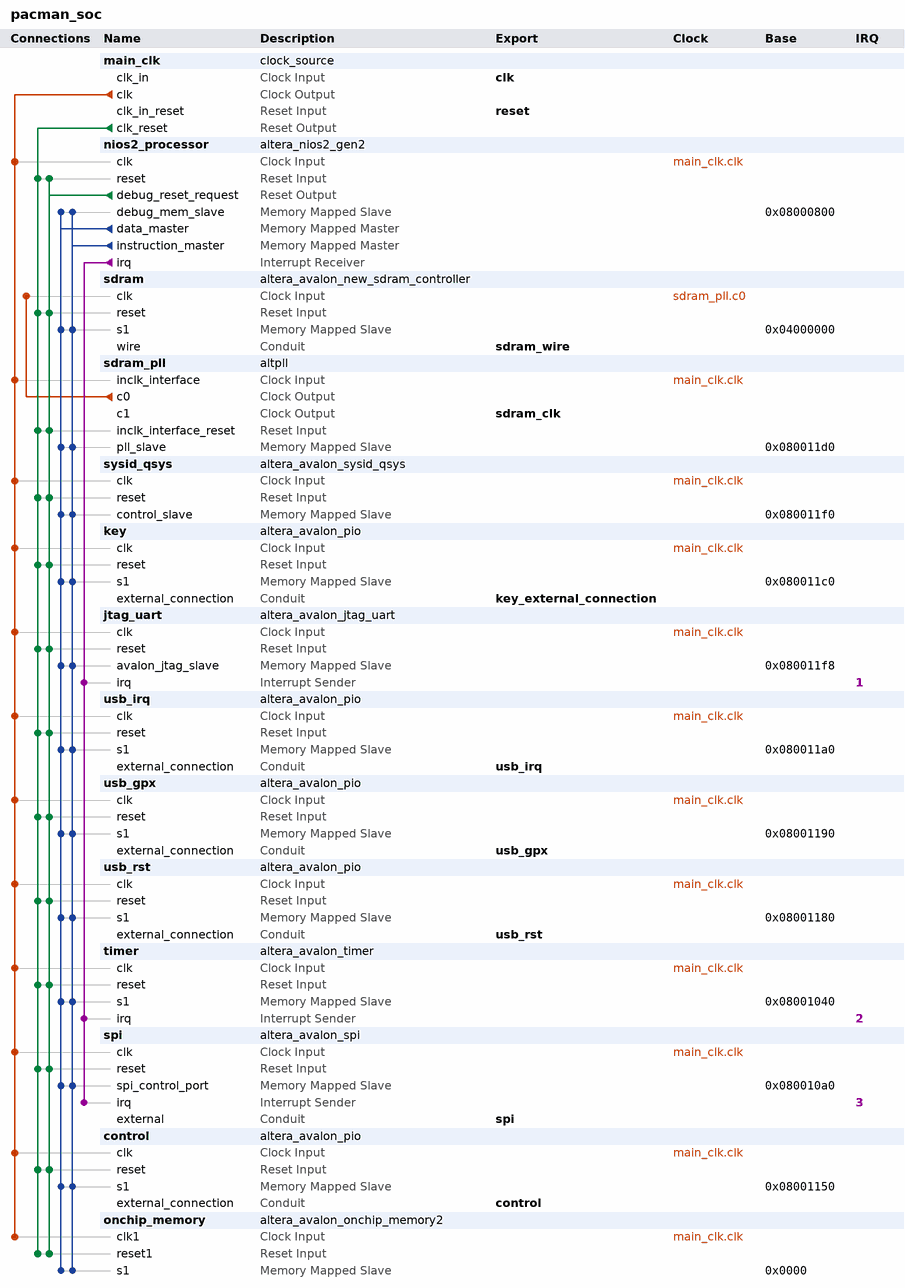
[diagram p0: system contents]
# Platform Designer (Qsys) system pacman_soc, MAX 10 10M50DAF484C7G
# Parameters at their usual value, and those the tool derives, are not listed.
package require -exact qsys 18.1
create_system pacman_soc
set_project_property DEVICE_FAMILY {MAX 10}
set_project_property DEVICE 10M50DAF484C7G

add_instance main_clk clock_source 18.1
set_instance_parameter_value main_clk clockFrequency 50000000

add_instance nios2_processor altera_nios2_gen2 18.1
set_instance_parameter_value nios2_processor dcache_size 2048
set_instance_parameter_value nios2_processor exceptionSlave sdram.s1
set_instance_parameter_value nios2_processor icache_size 4096
set_instance_parameter_value nios2_processor impl Tiny
set_instance_parameter_value nios2_processor resetSlave sdram.s1

add_instance sdram altera_avalon_new_sdram_controller 18.1
set_instance_parameter_value sdram TAC 5.5
set_instance_parameter_value sdram TRCD 20.0
set_instance_parameter_value sdram TRP 20.0
set_instance_parameter_value sdram casLatency 3
set_instance_parameter_value sdram columnWidth 10
set_instance_parameter_value sdram dataWidth 16
set_instance_parameter_value sdram generateSimulationModel false
set_instance_parameter_value sdram model single_Micron_MT48LC4M32B2_7_chip
set_instance_parameter_value sdram numberOfBanks 4
set_instance_parameter_value sdram numberOfChipSelects 1
set_instance_parameter_value sdram powerUpDelay 200.0
set_instance_parameter_value sdram refreshPeriod 15.625
set_instance_parameter_value sdram rowWidth 13

add_instance sdram_pll altpll 18.1
set_instance_parameter_value sdram_pll CLK0_DIVIDE_BY 1
set_instance_parameter_value sdram_pll CLK0_MULTIPLY_BY 1
set_instance_parameter_value sdram_pll CLK1_DIVIDE_BY 1
set_instance_parameter_value sdram_pll CLK1_DUTY_CYCLE 50
set_instance_parameter_value sdram_pll CLK1_MULTIPLY_BY 1
set_instance_parameter_value sdram_pll CLK1_PHASE_SHIFT -1000
set_instance_parameter_value sdram_pll INCLK0_INPUT_FREQUENCY 20000
set_instance_parameter_value sdram_pll PORT_ARESET PORT_UNUSED
set_instance_parameter_value sdram_pll PORT_LOCKED PORT_UNUSED
set_instance_parameter_value sdram_pll PORT_clk1 PORT_USED
set_instance_parameter_value sdram_pll PORT_clk2 PORT_UNUSED
set_instance_parameter_value sdram_pll PORT_clk3 PORT_UNUSED

add_instance sysid_qsys altera_avalon_sysid_qsys 18.1
set_instance_parameter_value sysid_qsys id 0

add_instance key altera_avalon_pio 18.1
set_instance_parameter_value key direction Input
set_instance_parameter_value key width 2

add_instance jtag_uart altera_avalon_jtag_uart 18.1
set_instance_parameter_value jtag_uart simInteractiveOptions NO_INTERACTIVE_WINDOWS

add_instance usb_irq altera_avalon_pio 18.1
set_instance_parameter_value usb_irq direction Input
set_instance_parameter_value usb_irq width 1

add_instance usb_gpx altera_avalon_pio 18.1
set_instance_parameter_value usb_gpx direction Input
set_instance_parameter_value usb_gpx width 1

add_instance usb_rst altera_avalon_pio 18.1
set_instance_parameter_value usb_rst direction Output
set_instance_parameter_value usb_rst width 1

add_instance timer altera_avalon_timer 18.1
set_instance_parameter_value timer counterSize 64
set_instance_parameter_value timer period 1
set_instance_parameter_value timer periodUnits MSEC

add_instance spi altera_avalon_spi 18.1
set_instance_parameter_value spi clockPolarity 0
set_instance_parameter_value spi dataWidth 8
set_instance_parameter_value spi masterSPI true
set_instance_parameter_value spi numberOfSlaves 1
set_instance_parameter_value spi targetClockRate 2500000

add_instance control altera_avalon_pio 18.1
set_instance_parameter_value control direction Output
set_instance_parameter_value control width 32

add_instance onchip_memory altera_avalon_onchip_memory2 18.1
set_instance_parameter_value onchip_memory dataWidth 32
set_instance_parameter_value onchip_memory dualPort false
set_instance_parameter_value onchip_memory initMemContent true
set_instance_parameter_value onchip_memory initializationFileName onchip_mem.hex
set_instance_parameter_value onchip_memory memorySize 131072

# connections
add_connection main_clk.clk control.clk clock
add_connection main_clk.clk jtag_uart.clk clock
add_connection main_clk.clk key.clk clock
add_connection main_clk.clk nios2_processor.clk clock
add_connection main_clk.clk onchip_memory.clk1 clock
add_connection main_clk.clk sdram_pll.inclk_interface clock
add_connection main_clk.clk spi.clk clock
add_connection main_clk.clk sysid_qsys.clk clock
add_connection main_clk.clk timer.clk clock
add_connection main_clk.clk usb_gpx.clk clock
add_connection main_clk.clk usb_irq.clk clock
add_connection main_clk.clk usb_rst.clk clock
add_connection sdram_pll.c0 sdram.clk clock
add_connection main_clk.clk_reset control.reset reset
add_connection main_clk.clk_reset jtag_uart.reset reset
add_connection main_clk.clk_reset key.reset reset
add_connection main_clk.clk_reset nios2_processor.reset reset
add_connection main_clk.clk_reset onchip_memory.reset1 reset
add_connection main_clk.clk_reset sdram.reset reset
add_connection main_clk.clk_reset sdram_pll.inclk_interface_reset reset
add_connection main_clk.clk_reset spi.reset reset
add_connection main_clk.clk_reset sysid_qsys.reset reset
add_connection main_clk.clk_reset timer.reset reset
add_connection main_clk.clk_reset usb_gpx.reset reset
add_connection main_clk.clk_reset usb_irq.reset reset
add_connection main_clk.clk_reset usb_rst.reset reset
add_connection nios2_processor.debug_reset_request control.reset reset
add_connection nios2_processor.debug_reset_request jtag_uart.reset reset
add_connection nios2_processor.debug_reset_request key.reset reset
add_connection nios2_processor.debug_reset_request nios2_processor.reset reset
add_connection nios2_processor.debug_reset_request onchip_memory.reset1 reset
add_connection nios2_processor.debug_reset_request sdram.reset reset
add_connection nios2_processor.debug_reset_request sdram_pll.inclk_interface_reset reset
add_connection nios2_processor.debug_reset_request spi.reset reset
add_connection nios2_processor.debug_reset_request sysid_qsys.reset reset
add_connection nios2_processor.debug_reset_request timer.reset reset
add_connection nios2_processor.debug_reset_request usb_gpx.reset reset
add_connection nios2_processor.debug_reset_request usb_irq.reset reset
add_connection nios2_processor.debug_reset_request usb_rst.reset reset
add_connection nios2_processor.data_master control.s1 avalon
set_connection_parameter_value nios2_processor.data_master/control.s1 baseAddress 0x08001150
add_connection nios2_processor.data_master jtag_uart.avalon_jtag_slave avalon
set_connection_parameter_value nios2_processor.data_master/jtag_uart.avalon_jtag_slave baseAddress 0x080011f8
add_connection nios2_processor.data_master key.s1 avalon
set_connection_parameter_value nios2_processor.data_master/key.s1 baseAddress 0x080011c0
add_connection nios2_processor.data_master nios2_processor.debug_mem_slave avalon
set_connection_parameter_value nios2_processor.data_master/nios2_processor.debug_mem_slave baseAddress 0x08000800
add_connection nios2_processor.data_master onchip_memory.s1 avalon
set_connection_parameter_value nios2_processor.data_master/onchip_memory.s1 baseAddress 0x0000
add_connection nios2_processor.data_master sdram.s1 avalon
set_connection_parameter_value nios2_processor.data_master/sdram.s1 baseAddress 0x04000000
add_connection nios2_processor.data_master sdram_pll.pll_slave avalon
set_connection_parameter_value nios2_processor.data_master/sdram_pll.pll_slave baseAddress 0x080011d0
add_connection nios2_processor.data_master spi.spi_control_port avalon
set_connection_parameter_value nios2_processor.data_master/spi.spi_control_port baseAddress 0x080010a0
add_connection nios2_processor.data_master sysid_qsys.control_slave avalon
set_connection_parameter_value nios2_processor.data_master/sysid_qsys.control_slave baseAddress 0x080011f0
add_connection nios2_processor.data_master timer.s1 avalon
set_connection_parameter_value nios2_processor.data_master/timer.s1 baseAddress 0x08001040
add_connection nios2_processor.data_master usb_gpx.s1 avalon
set_connection_parameter_value nios2_processor.data_master/usb_gpx.s1 baseAddress 0x08001190
add_connection nios2_processor.data_master usb_irq.s1 avalon
set_connection_parameter_value nios2_processor.data_master/usb_irq.s1 baseAddress 0x080011a0
add_connection nios2_processor.data_master usb_rst.s1 avalon
set_connection_parameter_value nios2_processor.data_master/usb_rst.s1 baseAddress 0x08001180
add_connection nios2_processor.instruction_master control.s1 avalon
set_connection_parameter_value nios2_processor.instruction_master/control.s1 baseAddress 0x08001150
add_connection nios2_processor.instruction_master jtag_uart.avalon_jtag_slave avalon
set_connection_parameter_value nios2_processor.instruction_master/jtag_uart.avalon_jtag_slave baseAddress 0x080011f8
add_connection nios2_processor.instruction_master key.s1 avalon
set_connection_parameter_value nios2_processor.instruction_master/key.s1 baseAddress 0x080011c0
add_connection nios2_processor.instruction_master nios2_processor.debug_mem_slave avalon
set_connection_parameter_value nios2_processor.instruction_master/nios2_processor.debug_mem_slave baseAddress 0x08000800
add_connection nios2_processor.instruction_master onchip_memory.s1 avalon
set_connection_parameter_value nios2_processor.instruction_master/onchip_memory.s1 baseAddress 0x0000
add_connection nios2_processor.instruction_master sdram.s1 avalon
set_connection_parameter_value nios2_processor.instruction_master/sdram.s1 baseAddress 0x04000000
add_connection nios2_processor.instruction_master sdram_pll.pll_slave avalon
set_connection_parameter_value nios2_processor.instruction_master/sdram_pll.pll_slave baseAddress 0x080011d0
add_connection nios2_processor.instruction_master spi.spi_control_port avalon
set_connection_parameter_value nios2_processor.instruction_master/spi.spi_control_port baseAddress 0x080010a0
add_connection nios2_processor.instruction_master sysid_qsys.control_slave avalon
set_connection_parameter_value nios2_processor.instruction_master/sysid_qsys.control_slave baseAddress 0x080011f0
add_connection nios2_processor.instruction_master timer.s1 avalon
set_connection_parameter_value nios2_processor.instruction_master/timer.s1 baseAddress 0x08001040
add_connection nios2_processor.instruction_master usb_gpx.s1 avalon
set_connection_parameter_value nios2_processor.instruction_master/usb_gpx.s1 baseAddress 0x08001190
add_connection nios2_processor.instruction_master usb_irq.s1 avalon
set_connection_parameter_value nios2_processor.instruction_master/usb_irq.s1 baseAddress 0x080011a0
add_connection nios2_processor.instruction_master usb_rst.s1 avalon
set_connection_parameter_value nios2_processor.instruction_master/usb_rst.s1 baseAddress 0x08001180
add_connection nios2_processor.irq jtag_uart.irq interrupt
set_connection_parameter_value nios2_processor.irq/jtag_uart.irq irqNumber 1
add_connection nios2_processor.irq spi.irq interrupt
set_connection_parameter_value nios2_processor.irq/spi.irq irqNumber 3
add_connection nios2_processor.irq timer.irq interrupt
set_connection_parameter_value nios2_processor.irq/timer.irq irqNumber 2

# exported interfaces
add_interface clk clock sink
set_interface_property clk EXPORT_OF main_clk.clk_in
add_interface control conduit end
set_interface_property control EXPORT_OF control.external_connection
add_interface key_external_connection conduit end
set_interface_property key_external_connection EXPORT_OF key.external_connection
add_interface reset reset sink
set_interface_property reset EXPORT_OF main_clk.clk_in_reset
add_interface sdram_clk clock source
set_interface_property sdram_clk EXPORT_OF sdram_pll.c1
add_interface sdram_wire conduit end
set_interface_property sdram_wire EXPORT_OF sdram.wire
add_interface spi conduit end
set_interface_property spi EXPORT_OF spi.external
add_interface usb_gpx conduit end
set_interface_property usb_gpx EXPORT_OF usb_gpx.external_connection
add_interface usb_irq conduit end
set_interface_property usb_irq EXPORT_OF usb_irq.external_connection
add_interface usb_rst conduit end
set_interface_property usb_rst EXPORT_OF usb_rst.external_connection

set_interconnect_requirement {$system} qsys_mm.clockCrossingAdapter HANDSHAKE
set_interconnect_requirement {$system} qsys_mm.enableEccProtection FALSE
set_interconnect_requirement {$system} qsys_mm.insertDefaultSlave FALSE
set_interconnect_requirement {$system} qsys_mm.maxAdditionalLatency 1

save_system pacman_soc.qsys
